# Altium schematic sheet DAC.SchDoc
size A4; Organization: Altium Limited; Address1: L3, 12a Rodborough Rd; Address2: Frenchs Forest; Address3: NSW; Address4: Australia 2086
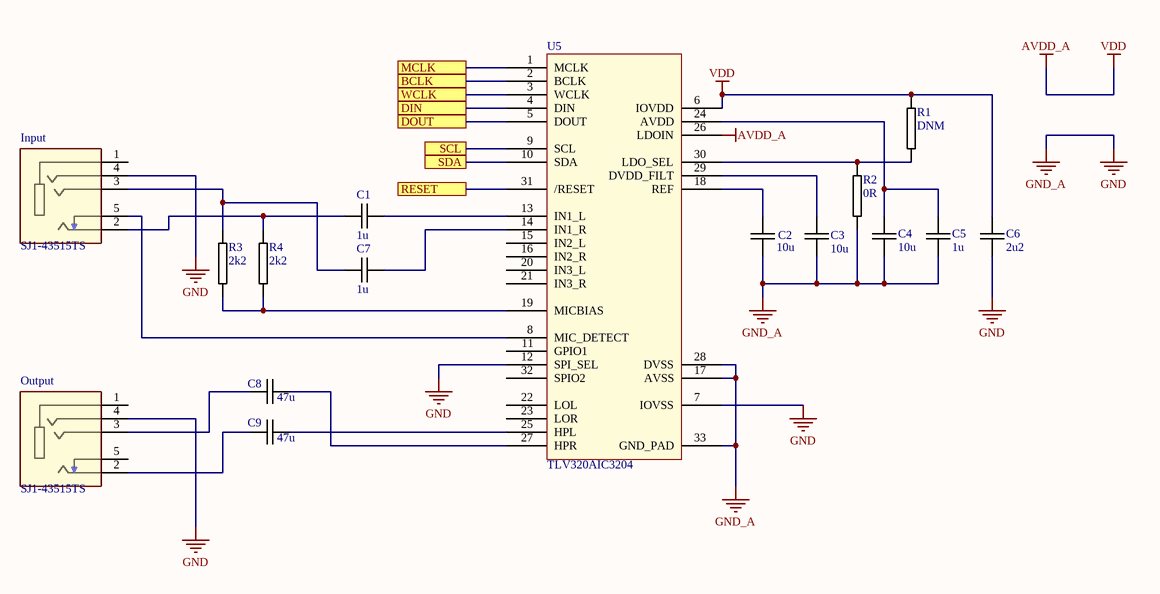
[diagram p0: DAC.SchDoc]

## Parts
C1  1u  [0402C-TBD]
C2  10u  [0603C-GENERIC]
C3  10u  [0603C-GENERIC]
C4  10u  [0603C-GENERIC]
C5  1u  [0402C-TBD]
C6  2u2  [0402C-TBD]
C7  1u  [0402C-TBD]
C8  47u  [1206C-GENERIC]
C9  47u  [1206C-GENERIC]
Input  SJ1-43515TS  [CUI_SJ-43515TS]
Output  SJ1-43515TS  [CUI_SJ-43515TS]
R1  DNM  [0402R-GENERIC]
R2  0R  [0402R-GENERIC]
R3  2k2  [0402R-GENERIC]
R4  2k2  [0402R-GENERIC]
U5  TLV320AIC3204  [QFN32]

## Ports
BCLK, DIN, DOUT, MCLK, RESET, SCL, SDA, WCLK

## Nets
AVDD_A: C6.1 R1.2 U5.6(IOVDD) U5.26(LDOIN)  [also labelled VDD]
GND: C2.2 C3.2 C4.2 C5.2 C6.2 Input.4 Output.4 R2.1 U5.7(IOVSS) U5.12(SPI_SEL) U5.17(AVSS) U5.28(DVSS) U5.33(GND_PAD)  [also labelled GND_A]
BCLK: U5.2(BCLK) ; port BCLK
DIN: U5.4(DIN) ; port DIN
DOUT: U5.5(DOUT) ; port DOUT
MCLK: U5.1(MCLK) ; port MCLK
RESET: U5.31(/RESET) ; port RESET
SCL: U5.9(SCL) ; port SCL
SDA: U5.10(SDA) ; port SDA
WCLK: U5.3(WCLK) ; port WCLK
NetC1_1: C1.1 Input.2 R4.2
NetC1_2: C1.2 U5.13(IN1_L)
NetC2_1: C2.1 U5.18(REF)
NetC3_1: C3.1 U5.29(DVDD_FILT)
NetC4_1: C4.1 C5.1 U5.24(AVDD)
NetC7_1: C7.1 U5.14(IN1_R)
NetC7_2: C7.2 Input.3 R3.2
NetC8_1: C8.1 U5.27(HPR)
NetC8_2: C8.2 Output.3
NetC9_1: C9.1 U5.25(HPL)
NetC9_2: C9.2 Output.2
NetInput_5: Input.5 U5.8(MIC_DETECT)
NetR1_1: R1.1 R2.2 U5.30(LDO_SEL)
NetR3_1: R3.1 R4.1 U5.19(MICBIAS)

Not connected (* = marked no-connect by the designer): Input 1; Output 1 5; U5 11(GPIO1) 15(IN2_L) 16(IN2_R) 20(IN3_L) 21(IN3_R) 22(LOL) 23(LOR) 32(SPIO2)

## Notes on the sheet
- Title
- Size:
- Date:
- A4
- Number:
- Time:
- Revision:
- Sheet
- of
- File:

## Library data of the parts
C1 C5-C7 = 0402C-TBD: CAPACITOR 0402 CERAMIC
C2-C4 = 0603C-000: CAPACITOR 0603 CERAMIC
C8 C9 = 1206C-2U2-50V: CAPACITOR 0603 CERAMIC; REEL: C100; Supplier 1: Digi-Key; Supplier Part Number 1: 490-4796-2-ND
Input Output = SJ1-42515TS: 2.5 mm, 4 Conductors, Right Angle, Through Hole, Audio Jack Connector; MF: CUI Devices; Price: None; Availability: Unavailable; Package: None; SnapEDA_Link: https://www.snapeda.com/parts/SJ1-42515TS/CUI%20Devices/view-part/1320737/?ref=snap; MP: SJ1-42515TS; CUI_purchase_URL: https://www.cuidevices.com/product/interconnect/connectors/audio-connectors/jacks/sj1-4251x-series?utm_source=snapeda.com&utm_medium=referral&utm_campaign=snapedaBOM; Value: *
R1-R4 = 0402R-GENERIC: RESISTOR 0402 GENERIC
U5 = TLV320AIC3204: The TLV320AIC3204(alsocalledthe AIC3204)is aflexible,low-power,low-voltagestereoaudiocodecwithprogrammableinputsand outputs,PowerTunecapabilities,fixedpredefinedandparameterizablesignal-processingblocks,integratedPLL,integratedLDOsand flexibledigitalinterfaces.